# Altium project CYAN_EVSE_Logic_board_v1.2.PrjPcb
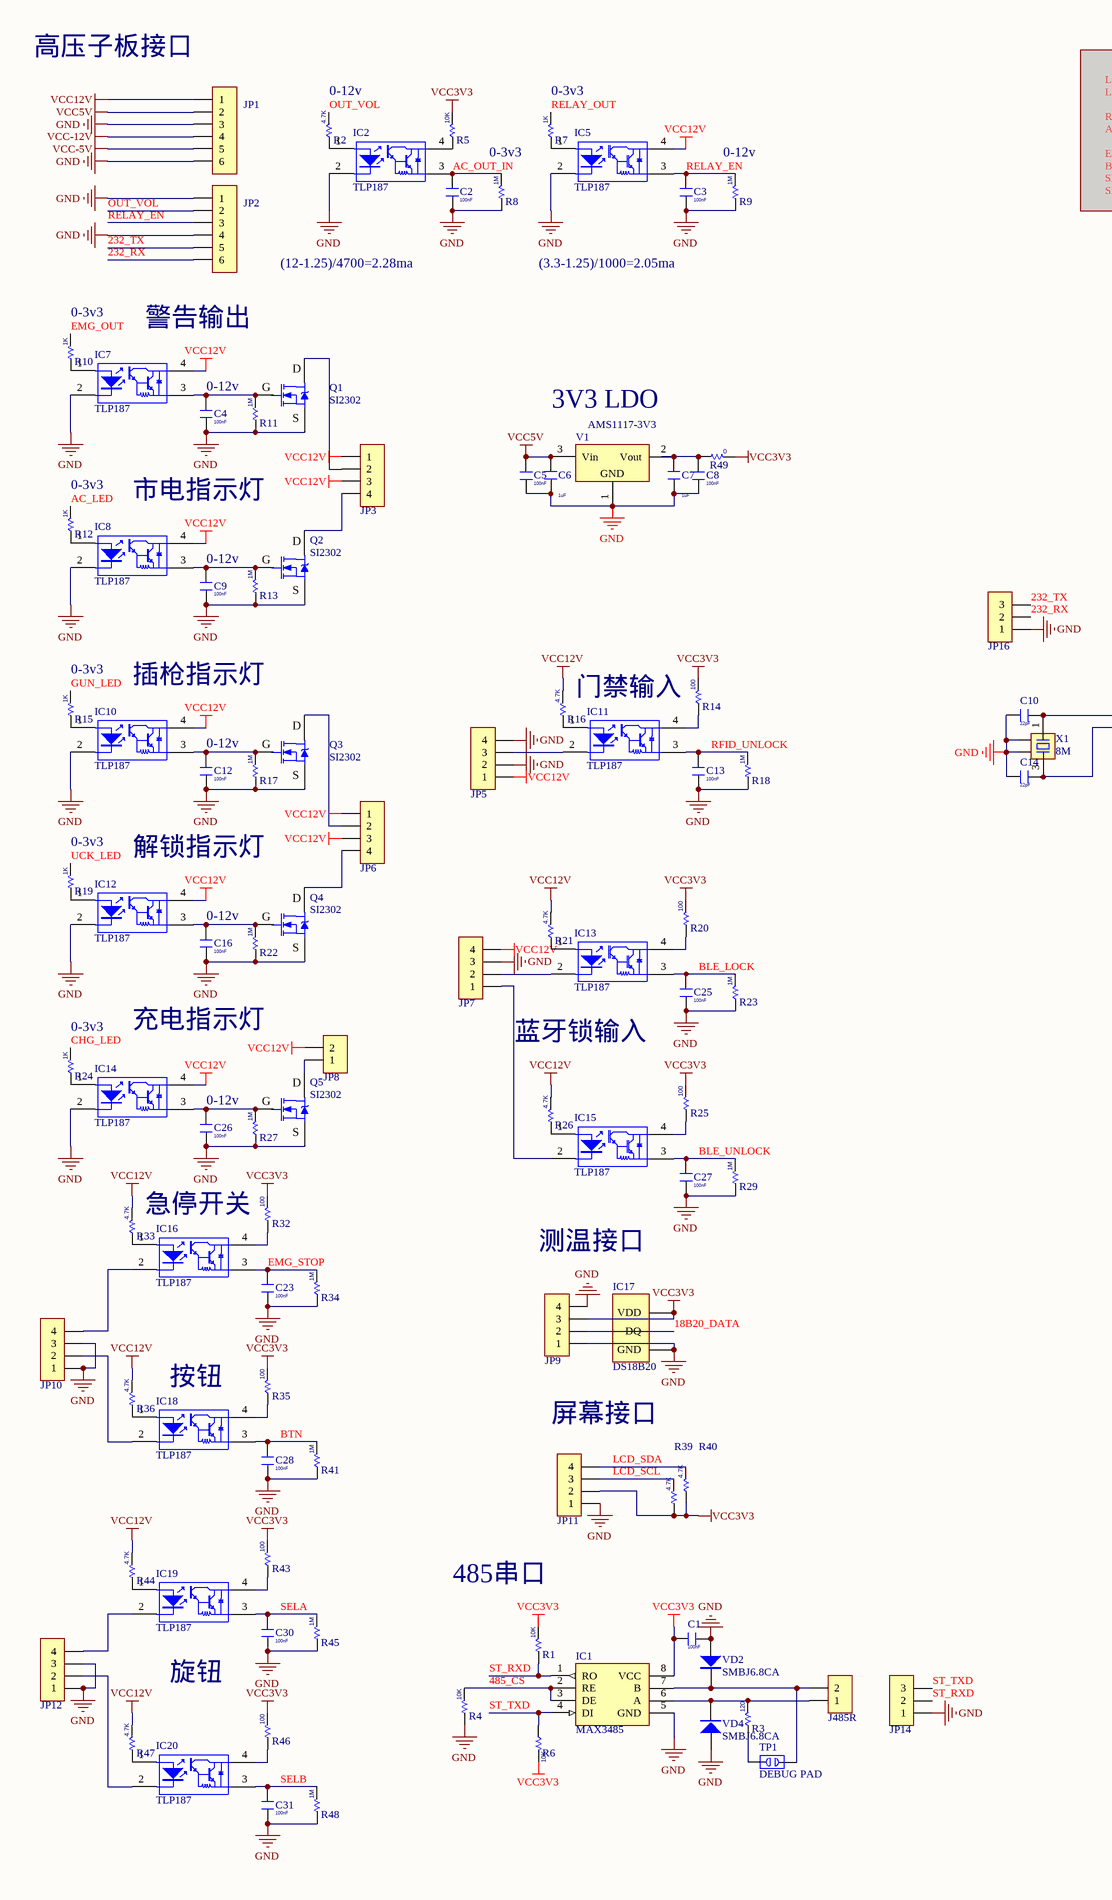
[diagram p0: CYAN_EVSE_Logic_board_v1.2.SchDoc, left]
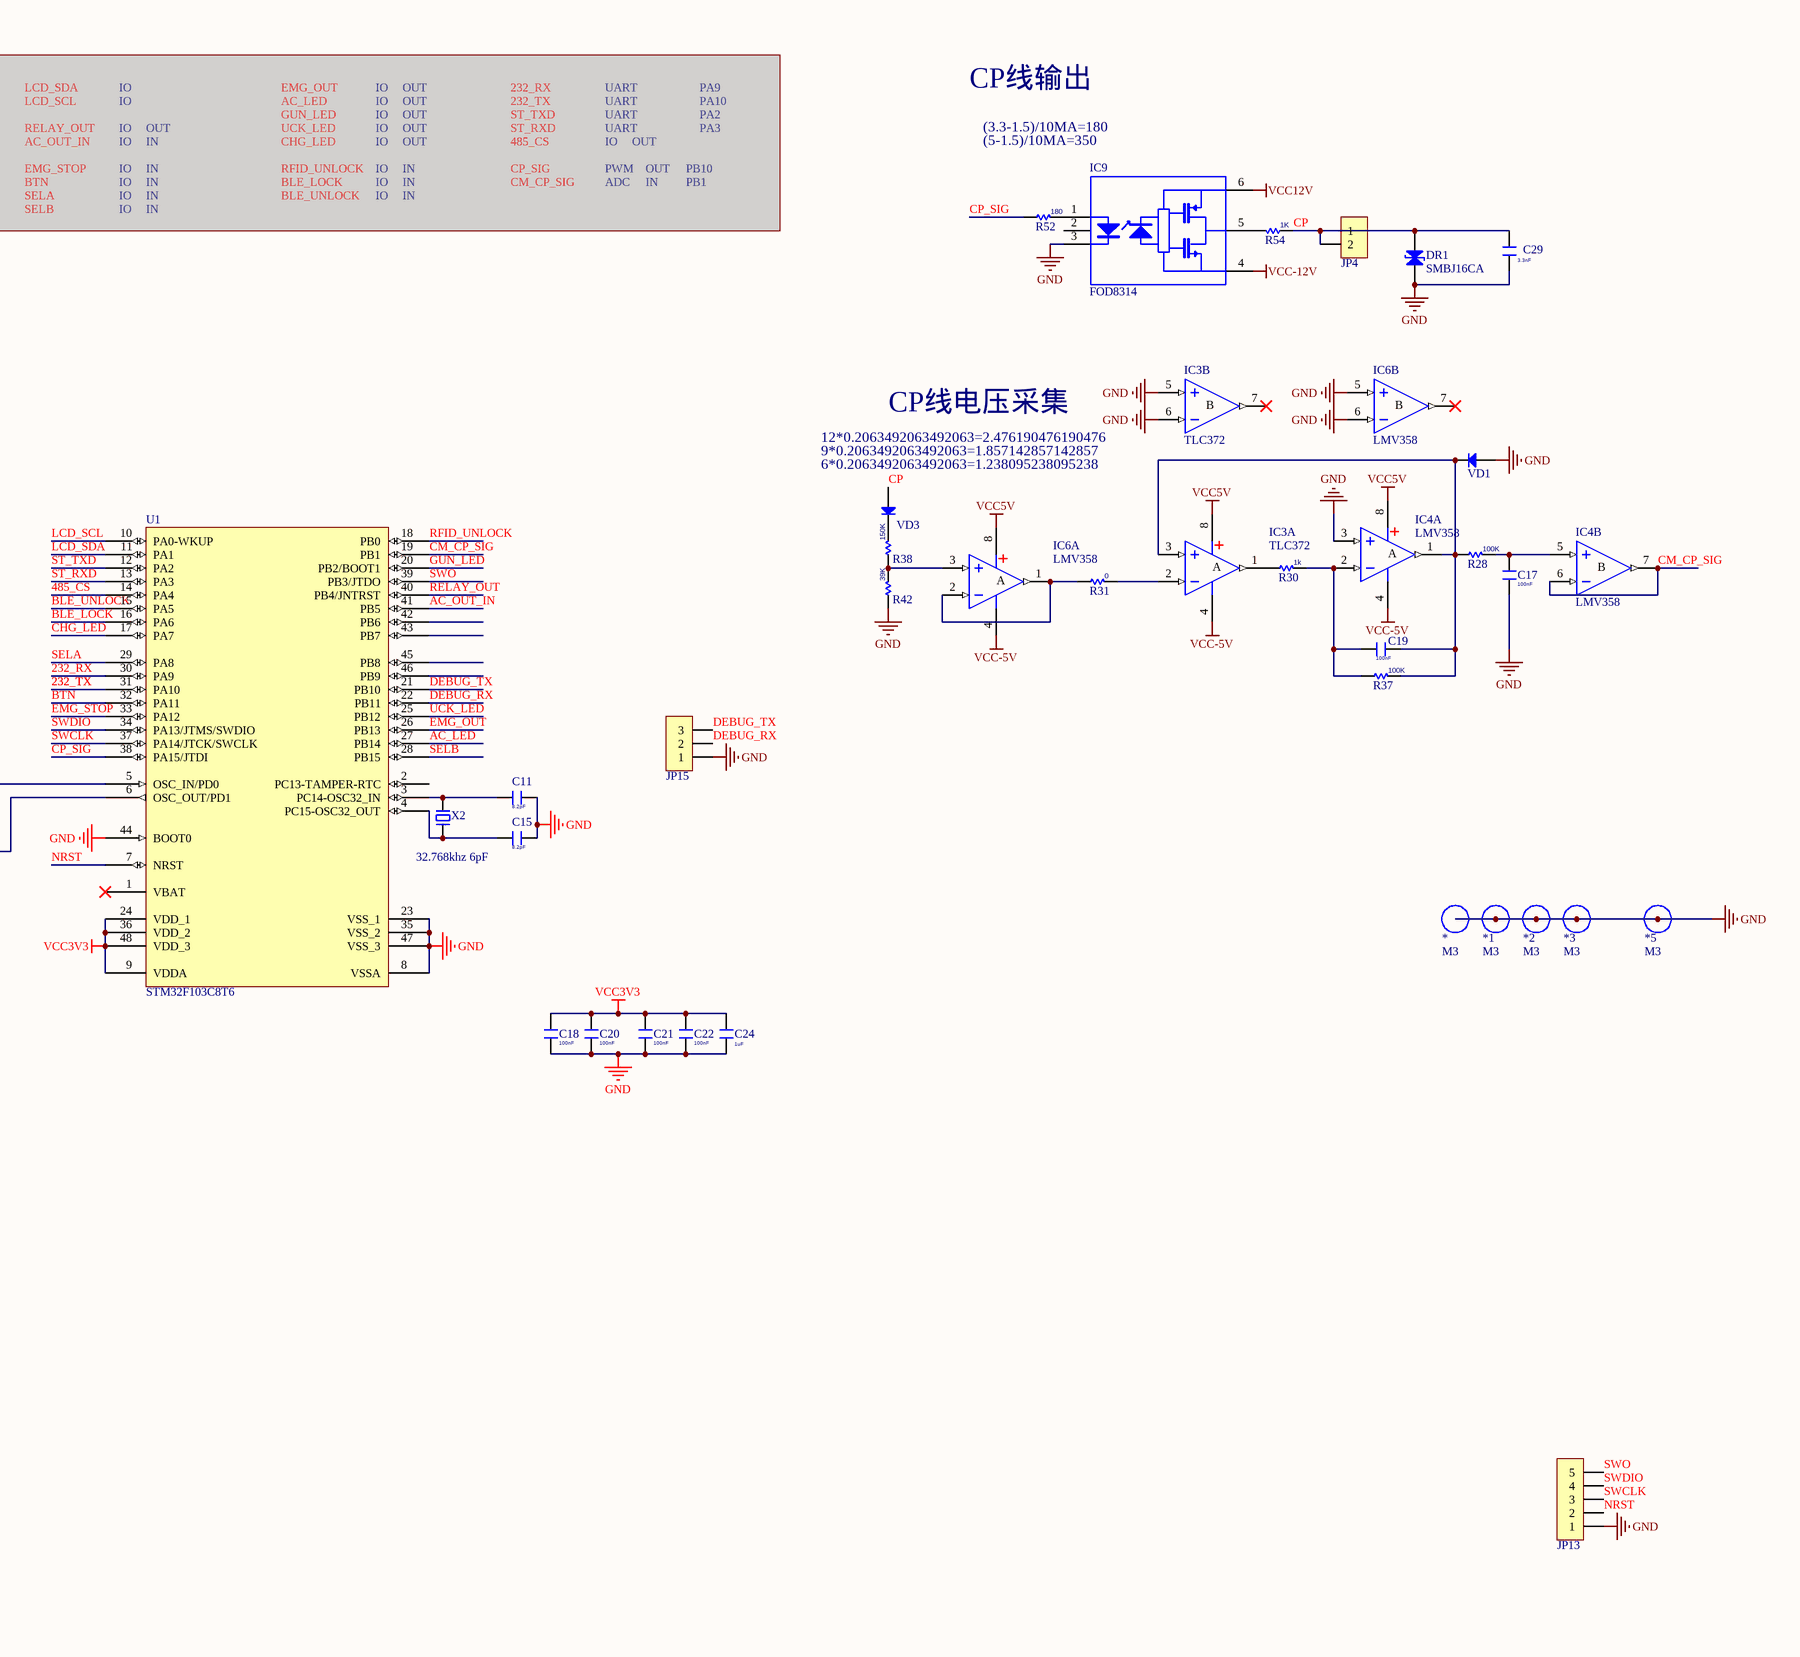
[diagram p1: CYAN_EVSE_Logic_board_v1.2.SchDoc, right]
1 sheet, 139 parts. Net scope: global (net labels, ports and power ports of the same name join across sheets).
Board file: CYAN_EVSE_Logic_board_v1.2.PcbDoc

## Sheet CYAN_EVSE_Logic_board_v1.2.SchDoc
size A2

### Parts
*  M3  [M3 125X300]
*1  M3  [M3 125X300]
*2  M3  [M3 125X300]
*3  M3  [M3 125X300]
*5  M3  [M3 125X300]
C1  value 100nF  [C 0805]  (hidden comment: C)
C2  value 100nF  [C 0805]  (hidden comment: C)
C3  value 100nF  [C 0805]  (hidden comment: C)
C4  value 100nF  [C 0805]  (hidden comment: C)
C5  value 100nF  [C 0805]  (hidden comment: C)
C6  value 1uF  [C 0805]  (hidden comment: C)
C7  value 1uF  [C 0805]  (hidden comment: C)
C8  value 100nF  [C 0805]  (hidden comment: C)
C9  value 100nF  [C 0805]  (hidden comment: C)
C10  value 22pF  [C 0805]  (hidden comment: C)
C11  value 8.2pF  [C 0805]  (hidden comment: C)
C12  value 100nF  [C 0805]  (hidden comment: C)
C13  value 100nF  [C 0805]  (hidden comment: C)
C14  value 22pF  [C 0805]  (hidden comment: C)
C15  value 8.2pF  [C 0805]  (hidden comment: C)
C16  value 100nF  [C 0805]  (hidden comment: C)
C17  value 100nF  [C 0805]  (hidden comment: C)
C18  value 100nF  [C 0805]  (hidden comment: C)
C19  value 100nF  [C 0805]  (hidden comment: C)
C20  value 100nF  [C 0805]  (hidden comment: C)
C21  value 100nF  [C 0805]  (hidden comment: C)
C22  value 100nF  [C 0805]  (hidden comment: C)
C23  value 100nF  [C 0805]  (hidden comment: C)
C24  value 1uF  [C 0805]  (hidden comment: C)
C25  value 100nF  [C 0805]  (hidden comment: C)
C26  value 100nF  [C 0805]  (hidden comment: C)
C27  value 100nF  [C 0805]  (hidden comment: C)
C28  value 100nF  [C 0805]  (hidden comment: C)
C29  value 3.3nF  [C 1206]  (hidden comment: C)
C30  value 100nF  [C 0805]  (hidden comment: C)
C31  value 100nF  [C 0805]  (hidden comment: C)
DR1  SMBJ16CA  [SMB]
IC1  MAX3485  [SOP8_N]
IC2  TLP187  [SOP6_4.6MM_W1.27_4PIN_N]
IC3  TLC372  [SOP8_N]  (parts A,B of 2)
IC4  LMV358  [SOP8_N]  (parts A,B of 2)
IC5  TLP187  [SOP6_4.6MM_W1.27_4PIN_N]
IC6  LMV358  [SOP8_N]  (parts A,B of 2)
IC7  TLP187  [SOP6_4.6MM_W1.27_4PIN_N]
IC8  TLP187  [SOP6_4.6MM_W1.27_4PIN_N]
IC9  FOD8314  [SOP6_7MM_WIDE_LEAD_N]
IC10  TLP187  [SOP6_4.6MM_W1.27_4PIN_N]
IC11  TLP187  [SOP6_4.6MM_W1.27_4PIN_N]
IC12  TLP187  [SOP6_4.6MM_W1.27_4PIN_N]
IC13  TLP187  [SOP6_4.6MM_W1.27_4PIN_N]
IC14  TLP187  [SOP6_4.6MM_W1.27_4PIN_N]
IC15  TLP187  [SOP6_4.6MM_W1.27_4PIN_N]
IC16  TLP187  [SOP6_4.6MM_W1.27_4PIN_N]
IC17  DS18B20  [TO92A]
IC18  TLP187  [SOP6_4.6MM_W1.27_4PIN_N]
IC19  TLP187  [SOP6_4.6MM_W1.27_4PIN_N]
IC20  TLP187  [SOP6_4.6MM_W1.27_4PIN_N]
J485R  HDR-1X2  [MC 1,5/ 2-G-3,81]  (value not drawn)
JP1  HDR-1X6  [XH2.54-6P]  (value not drawn)
JP2  HDR-1X6  [XH2.54-6P]  (value not drawn)
JP3  HDR-1X4  [MC 1,5/ 4-G-3,81]  (value not drawn)
JP4  HDR-1X2  [MC 1,5/ 2-G-3,81]  (value not drawn)
JP5  HDR-1X4  [MC 1,5/ 4-G-3,81]  (value not drawn)
JP6  HDR-1X4  [MC 1,5/ 4-G-3,81]  (value not drawn)
JP7  HDR-1X4  [MC 1,5/ 4-G-3,81]  (value not drawn)
JP8  HDR-1X2  [MC 1,5/ 2-G-3,81]  (value not drawn)
JP9  HDR-1X4  [MC 1,5/ 4-G-3,81]  (value not drawn)
JP10  HDR-1X4  [MC 1,5/ 4-G-3,81]  (value not drawn)
JP11  HDR-1X4  [XH2.54-4P]  (value not drawn)
JP12  HDR-1X4  [MC 1,5/ 4-G-3,81]  (value not drawn)
JP13  HDR-1X5  [HDR-1X5]  (value not drawn)
JP14  HDR-1X3  [HDR-1X3]  (value not drawn)
JP15  HDR-1X3  [HDR-1X3]  (value not drawn)
JP16  HDR-1X3  [HDR-1X3]  (value not drawn)
Q1  SI2302  [SOT23-3N]
Q2  SI2302  [SOT23-3N]
Q3  SI2302  [SOT23-3N]
Q4  SI2302  [SOT23-3N]
Q5  SI2302  [SOT23-3N]
R1  value 10K  [R 0805]  (hidden comment: R)
R2  value 4.7K  [R 0805]  (hidden comment: R)
R3  value 120  [R 1206]  (hidden comment: R)
R4  value 10K  [R 0805]  (hidden comment: R)
R5  value 10K  [R 0805]  (hidden comment: R)
R6  value 10K  [R 0805]  (hidden comment: R)
R7  value 1K  [R 0805]  (hidden comment: R)
R8  value 1M  [R 0805]  (hidden comment: R)
R9  value 1M  [R 0805]  (hidden comment: R)
R10  value 1K  [R 0805]  (hidden comment: R)
R11  value 1M  [R 0805]  (hidden comment: R)
R12  value 1K  [R 0805]  (hidden comment: R)
R13  value 1M  [R 0805]  (hidden comment: R)
R14  value 100  [R 0805]  (hidden comment: R)
R15  value 1K  [R 0805]  (hidden comment: R)
R16  value 4.7K  [R 0805]  (hidden comment: R)
R17  value 1M  [R 0805]  (hidden comment: R)
R18  value 1M  [R 0805]  (hidden comment: R)
R19  value 1K  [R 0805]  (hidden comment: R)
R20  value 100  [R 0805]  (hidden comment: R)
R21  value 4.7K  [R 0805]  (hidden comment: R)
R22  value 1M  [R 0805]  (hidden comment: R)
R23  value 1M  [R 0805]  (hidden comment: R)
R24  value 1K  [R 0805]  (hidden comment: R)
R25  value 100  [R 0805]  (hidden comment: R)
R26  value 4.7K  [R 0805]  (hidden comment: R)
R27  value 1M  [R 0805]  (hidden comment: R)
R28  value 100K  [R 0805]  (hidden comment: R)
R29  value 1M  [R 0805]  (hidden comment: R)
R30  value 1k  [R 0805]  (hidden comment: R)
R31  value 0  [R 0805]  (hidden comment: R)
R32  value 100  [R 0805]  (hidden comment: R)
R33  value 4.7K  [R 0805]  (hidden comment: R)
R34  value 1M  [R 0805]  (hidden comment: R)
R35  value 100  [R 0805]  (hidden comment: R)
R36  value 4.7K  [R 0805]  (hidden comment: R)
R37  value 100K  [R 0805]  (hidden comment: R)
R38  value 150K  [R 0805]  (hidden comment: R)
R39  value 4.7K  [R 0805]  (hidden comment: R)
R40  value 4.7K  [R 0805]  (hidden comment: R)
R41  value 1M  [R 0805]  (hidden comment: R)
R42  value 39K  [R 0805]  (hidden comment: R)
R43  value 100  [R 0805]  (hidden comment: R)
R44  value 4.7K  [R 0805]  (hidden comment: R)
R45  value 1M  [R 0805]  (hidden comment: R)
R46  value 100  [R 0805]  (hidden comment: R)
R47  value 4.7K  [R 0805]  (hidden comment: R)
R48  value 1M  [R 0805]  (hidden comment: R)
R49  value 0  [R 0805]  (hidden comment: R)
R52  value 180  [R 0805]  (hidden comment: R)
R54  value 1K  [R 1206]  (hidden comment: R)
TP1  DEBUG PAD  [DEBUG PAD2]
U1  STM32F103C8T6  [LQFP48 7X7_M]
V1  AMS1117-3V3  [SOT223_L]
VD1  1N4148  [SOD-323]  (value not drawn)
VD2  SMBJ6.8CA  [SMB]
VD3  1N4148  [SOD-323]  (value not drawn)
VD4  SMBJ6.8CA  [SMB]
X1  8M  [XTAL-3225]
X2  32.768khz 6pF  [XTAL-3215]

### Nets
GND: *.0 *1.0 *2.0 *3.0 *5.0 C1.1 C2.1 C3.1 C4.1 C5.1 C6.2 C7.2 C8.1 C9.1 C10.2 C11.1 C12.1 C13.1 C14.2 C15.1 C16.1 C17.2 C18.1 C20.1 C21.1 C22.1 C23.1 C24.2 C25.1 C26.1 C27.1 C28.1 C29.1 C30.1 C31.1 DR1.2(K) IC1.5(GND) IC2.2(K) IC3.5(IN+) IC3.6(IN-) IC4.3(IN+) IC5.2(K) IC6.5(IN+) IC6.6(IN-) IC7.2(K) IC8.2(K) IC9.3(K) IC10.2(K) IC12.2(K) IC14.2(K) IC17.1(GND) JP1.3 JP1.6 JP2.1 JP2.4 JP5.2 JP5.4 JP7.3 JP9.1 JP9.4 JP10.1 JP10.3 JP11.1 JP12.1 JP12.3 JP13.1 JP14.1 JP15.1 JP16.1 Q1.2(S) Q2.2(S) Q3.2(S) Q4.2(S) Q5.2(S) R4.1 R8.1 R9.1 R11.1 R13.1 R17.1 R18.1 R22.1 R23.1 R27.1 R29.1 R34.1 R41.1 R42.1 R45.1 R48.1 U1.8(VSSA) U1.23(VSS_1) U1.35(VSS_2) U1.44(BOOT0) U1.47(VSS_3) V1.1(GND) VD1.1(A) VD2.1(A) VD4.1(A) X1.2 X1.4
VCC3V3: C1.2 C18.2 C20.2 C21.2 C22.2 C24.1 IC1.8(VCC) IC17.3(VDD) JP9.3 JP11.2 R1.2 R5.2 R6.2 R14.2 R20.2 R25.2 R32.2 R35.2 R39.1 R40.1 R43.2 R46.2 R49.2 U1.9(VDDA) U1.24(VDD_1) U1.36(VDD_2) U1.48(VDD_3)
VCC5V: C5.2 C6.1 IC3.8(V+) IC4.8(V+) IC6.8(V+) JP1.2 V1.3(Vin)
VCC12V: IC5.4(C) IC7.4(C) IC8.4(C) IC9.6(VDD) IC10.4(C) IC12.4(C) IC14.4(C) JP1.1 JP3.1 JP3.3 JP5.1 JP6.1 JP6.3 JP7.4 JP8.2 R16.2 R21.2 R26.2 R33.2 R36.2 R44.2 R47.2
VCC-5V: IC3.4(V-) IC4.4(V-) IC6.4(V-) JP1.5
VCC-12V: IC9.4(VSS) JP1.4
18B20_DATA: IC17.2(DQ) JP9.2
232_RX: JP2.6 JP16.2 U1.30(PA9)
232_TX: JP2.5 JP16.3 U1.31(PA10)
485_CS: IC1.2(RE) IC1.3(DE) R4.2 U1.14(PA4)
AC_LED: R12.2 U1.27(PB14)
AC_OUT_IN: C2.2 IC2.3(E) R8.2 U1.41(PB5)
BLE_LOCK: C25.2 IC13.3(E) R23.2 U1.16(PA6)
BLE_UNLOCK: C27.2 IC15.3(E) R29.2 U1.15(PA5)
BTN: C28.2 IC18.3(E) R41.2 U1.32(PA11)
CHG_LED: R24.2 U1.17(PA7)
CM_CP_SIG: IC4.6(IN-) IC4.7(OUT) U1.19(PB1)
CP: C29.2 DR1.1(A) JP4.1 JP4.2 R54.1 VD3.1(A)
CP_SIG: R52.1 U1.38(PA15/JTDI)
DEBUG_RX: JP15.2 U1.22(PB11)
DEBUG_TX: JP15.3 U1.21(PB10)
EMG_OUT: R10.2 U1.26(PB13)
EMG_STOP: C23.2 IC16.3(E) R34.2 U1.33(PA12)
GUN_LED: R15.2 U1.20(PB2/BOOT1)
LCD_SCL: JP11.3 R39.2 U1.10(PA0-WKUP)
LCD_SDA: JP11.4 R40.2 U1.11(PA1)
NRST: JP13.2 U1.7(NRST)
OUT_VOL: JP2.2 R2.2
RELAY_EN: C3.2 IC5.3(E) JP2.3 R9.2
RELAY_OUT: R7.2 U1.40(PB4/JNTRST)
RFID_UNLOCK: C13.2 IC11.3(E) R18.2 U1.18(PB0)
SELA: C30.2 IC19.3(E) R45.2 U1.29(PA8)
SELB: C31.2 IC20.3(E) R48.2 U1.28(PB15)
ST_RXD: IC1.1(RO) JP14.2 R1.1 U1.13(PA3)
ST_TXD: IC1.4(DI) JP14.3 R6.1 U1.12(PA2)
SWCLK: JP13.3 U1.37(PA14/JTCK/SWCLK)
SWDIO: JP13.4 U1.34(PA13/JTMS/SWDIO)
SWO: JP13.5 U1.39(PB3/JTDO)
UCK_LED: R19.2 U1.25(PB12)
NetC4_2: C4.2 IC7.3(E) Q1.1(G) R11.2
NetC7_1: C7.1 C8.2 R49.1 V1.2(Vout)
NetC9_2: C9.2 IC8.3(E) Q2.1(G) R13.2
NetC10_1: C10.1 U1.5(OSC_IN/PD0) X1.1
NetC11_2: C11.2 U1.3(PC14-OSC32_IN) X2.2
NetC12_2: C12.2 IC10.3(E) Q3.1(G) R17.2
NetC14_1: C14.1 U1.6(OSC_OUT/PD1) X1.3
NetC15_2: C15.2 U1.4(PC15-OSC32_OUT) X2.1
NetC16_2: C16.2 IC12.3(E) Q4.1(G) R22.2
NetC17_1: C17.1 IC4.5(IN+) R28.2
NetC19_1: C19.1 IC3.3(IN+) IC4.1(OUT) R28.1 R37.2 VD1.2(K)
NetC19_2: C19.2 IC4.2(IN-) R30.2 R37.1
NetC26_2: C26.2 IC14.3(E) Q5.1(G) R27.2
NetIC1_6: IC1.6(A) J485R.1 R3.2 VD4.2(K)
NetIC1_7: IC1.7(B) J485R.2 TP1.2 VD2.2(K)
NetIC2_1: IC2.1(A) R2.1
NetIC2_4: IC2.4(C) R5.1
NetIC3_1: IC3.1(OUT) R30.1
NetIC3_2: IC3.2(IN-) R31.2
NetIC5_1: IC5.1(A) R7.1
NetIC6_1: IC6.1(OUT) IC6.2(IN-) R31.1
NetIC6_3: IC6.3(IN+) R38.1 R42.2
NetIC7_1: IC7.1(A) R10.1
NetIC8_1: IC8.1(A) R12.1
NetIC9_1: IC9.1(A) R52.2
NetIC9_5: IC9.5(OUT) R54.2
NetIC10_1: IC10.1(A) R15.1
NetIC11_1: IC11.1(A) R16.1
NetIC11_2: IC11.2(K) JP5.3
NetIC11_4: IC11.4(C) R14.1
NetIC12_1: IC12.1(A) R19.1
NetIC13_1: IC13.1(A) R21.1
NetIC13_2: IC13.2(K) JP7.2
NetIC13_4: IC13.4(C) R20.1
NetIC14_1: IC14.1(A) R24.1
NetIC15_1: IC15.1(A) R26.1
NetIC15_2: IC15.2(K) JP7.1
NetIC15_4: IC15.4(C) R25.1
NetIC16_1: IC16.1(A) R33.1
NetIC16_2: IC16.2(K) JP10.4
NetIC16_4: IC16.4(C) R32.1
NetIC18_1: IC18.1(A) R36.1
NetIC18_2: IC18.2(K) JP10.2
NetIC18_4: IC18.4(C) R35.1
NetIC19_1: IC19.1(A) R44.1
NetIC19_2: IC19.2(K) JP12.4
NetIC19_4: IC19.4(C) R43.1
NetIC20_1: IC20.1(A) R47.1
NetIC20_2: IC20.2(K) JP12.2
NetIC20_4: IC20.4(C) R46.1
NetJP3_2: JP3.2 Q1.3(D)
NetJP3_4: JP3.4 Q2.3(D)
NetJP6_2: JP6.2 Q3.3(D)
NetJP6_4: JP6.4 Q4.3(D)
NetJP8_1: JP8.1 Q5.3(D)
NetR3_1: R3.1 TP1.1
NetR38_2: R38.2 VD3.2(K)

Not connected (* = marked no-connect by the designer): IC3 7(OUT)*; IC6 7(OUT)*; IC9 2(NC); U1 1(VBAT)* 2(PC13-TAMPER-RTC) 42(PB6) 43(PB7) 45(PB8) 46(PB9)

### Notes on the sheet
- 高压子板接口
- IO
- OUT
- UART
- PA9
- CP线输出
- (near R2) 0-12v
- (near R7) 0-3v3
- IN
- PA10
- PA2
- PA3
- (3.3-1.5)/10MA=180
- (near IC9) (5-1.5)/10MA=350
- 0-3v3
- (near R9) 0-12v
- PWM
- ADC
- PB10
- PB1
- (12-1.25)/4700=2.28ma
- (3.3-1.25)/1000=2.05ma
- (near R10) 0-3v3
- 警告输出
- 0-12v
- CP线电压采集
- 3V3 LDO
- 12*0.2063492063492063=2.476190476190476
- (near VD3) 9*0.2063492063492063=1.857142857142857
- (near VD3) 6*0.2063492063492063=1.238095238095238
- (near R12) 0-3v3
- (near IC8) 市电指示灯
- (near R15) 0-3v3
- (near IC10) 插枪指示灯
- (near R16) 门禁输入
- (near R19) 0-3v3
- (near IC12) 解锁指示灯
- (near R24) 0-3v3
- 充电指示灯
- 蓝牙锁输入
- (near R33) 急停开关
- 测温接口
- 按钮
- 屏幕接口
- 485串口
- 旋钮
- (in symbol LM358, part A) A
- (in symbol LM358, part B) B
- (in symbol TLC372, part A) A
- (in symbol TLC372, part B) B

### Library data of the parts
* *1-*3 *5 = M3: 铜柱孔
C1-C5 C8-C23 C25-C28 C30 C31 = C: 无极性贴片电容; Voltage: 20V
C6 C7 C24 = C: 无极性贴片电容
C29 = C: 无极性贴片电容; Voltage: 50V
DR1 = DR: 瞬态电压抑制二极管
IC1 = MAX487: RS485总线收发芯片
IC2 IC5 IC7 IC8 IC10-IC16 IC18-IC20 = TLP187: 达林顿输出光耦
IC3 = TLC372: 双路电压比较,MOS下臂输出
IC4 IC6 = LM358: 双路运放
IC9 = FOD8314: MOSFET/IGBT 驱动光耦，15-30v 1a
IC17 = DS18B20: 数字温度计
J485R JP4 JP8 = Header 2: 2P接插件
JP1 JP2 = Header 6: 6P接插件
JP3 JP5-JP7 JP9-JP12 = Header 4: 4P接插件
JP13 = Header 5: 5P接插件
JP14-JP16 = Header 3: 3P接插件
Q1-Q5 = SI2302: N沟道场效应管
R1-R49 R52 R54 = R: 贴片电阻
TP1 = DEBUG: 调试断点焊盘
U1 = STM32F103C8T6: Flaah:64/RAM:20/IO:36
V1 = AMS1117: 三端稳压芯片
VD1 VD3 = 1N4148: 高速开关二极管
VD2 VD4 = SS14: 肖特基二极管
X1 = XTAL-4: 4脚晶振
X2 = XTAL-2: 2脚晶振